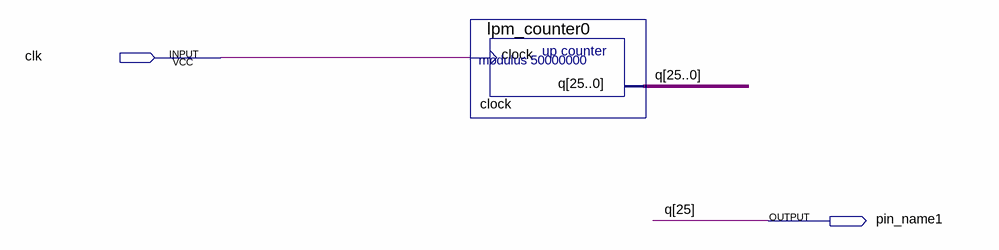
[diagram p0: schematic sheet]
// Quartus schematic 3_1.bdf as structural Verilog: 1 symbols, 2 pins
module \3_1  (
  input  clk,
  output pin_name1
);

  wire [24:0] q;

  lpm_counter0 clock (.clock(clk), .q({pin_name1, q}));

  // Other names for the same wires on the sheet: q[25] = pin_name1
endmodule
